# EAGLE board EDCPSUMK2_2040 (EAGLE 9.6.2)
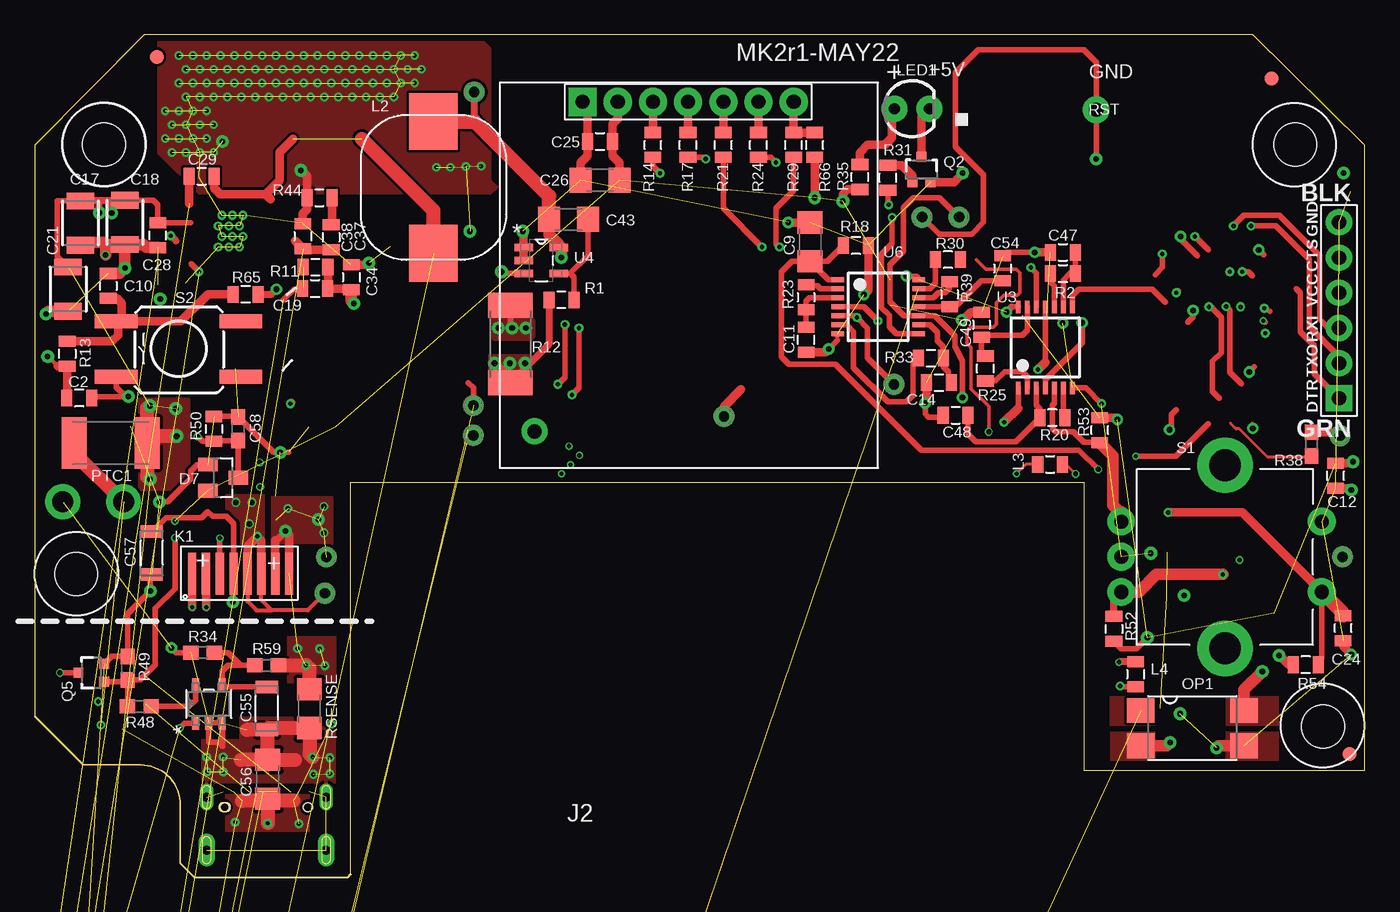
[diagram p5: board, top side]
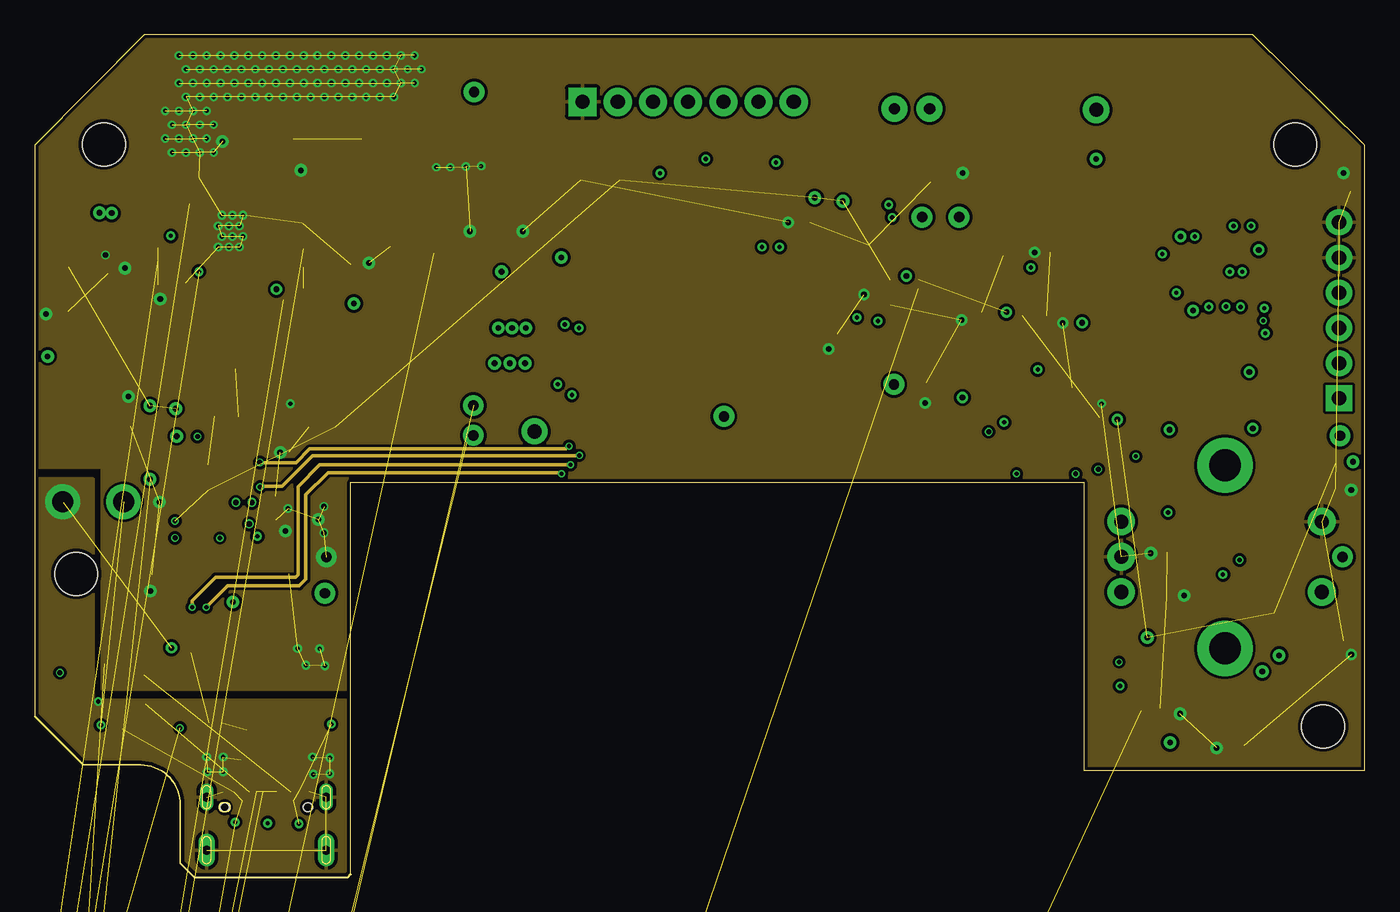
[diagram p6: board, inner layer GND]
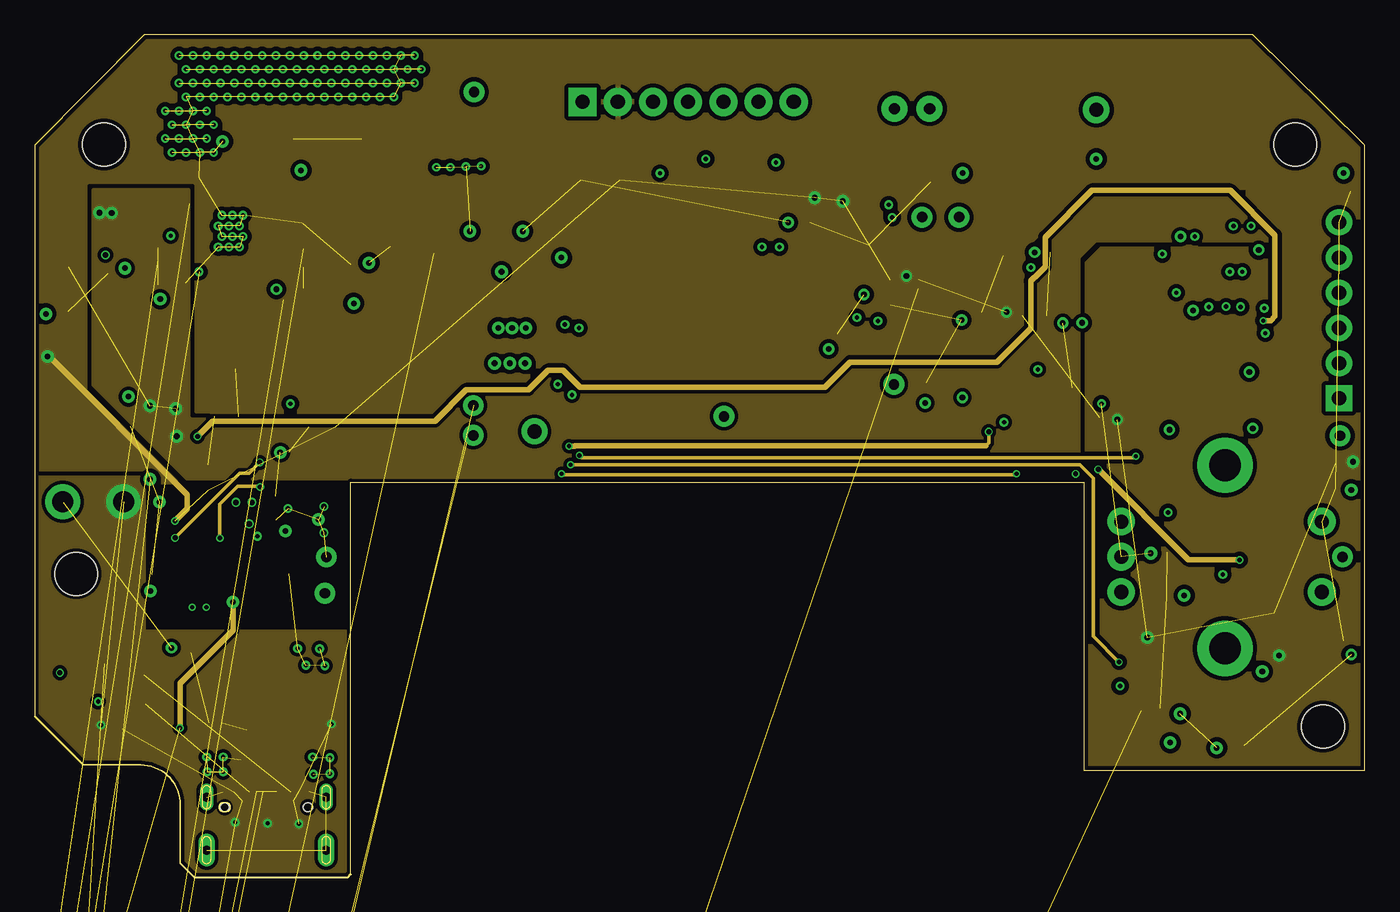
[diagram p7: board, inner layer PWR]
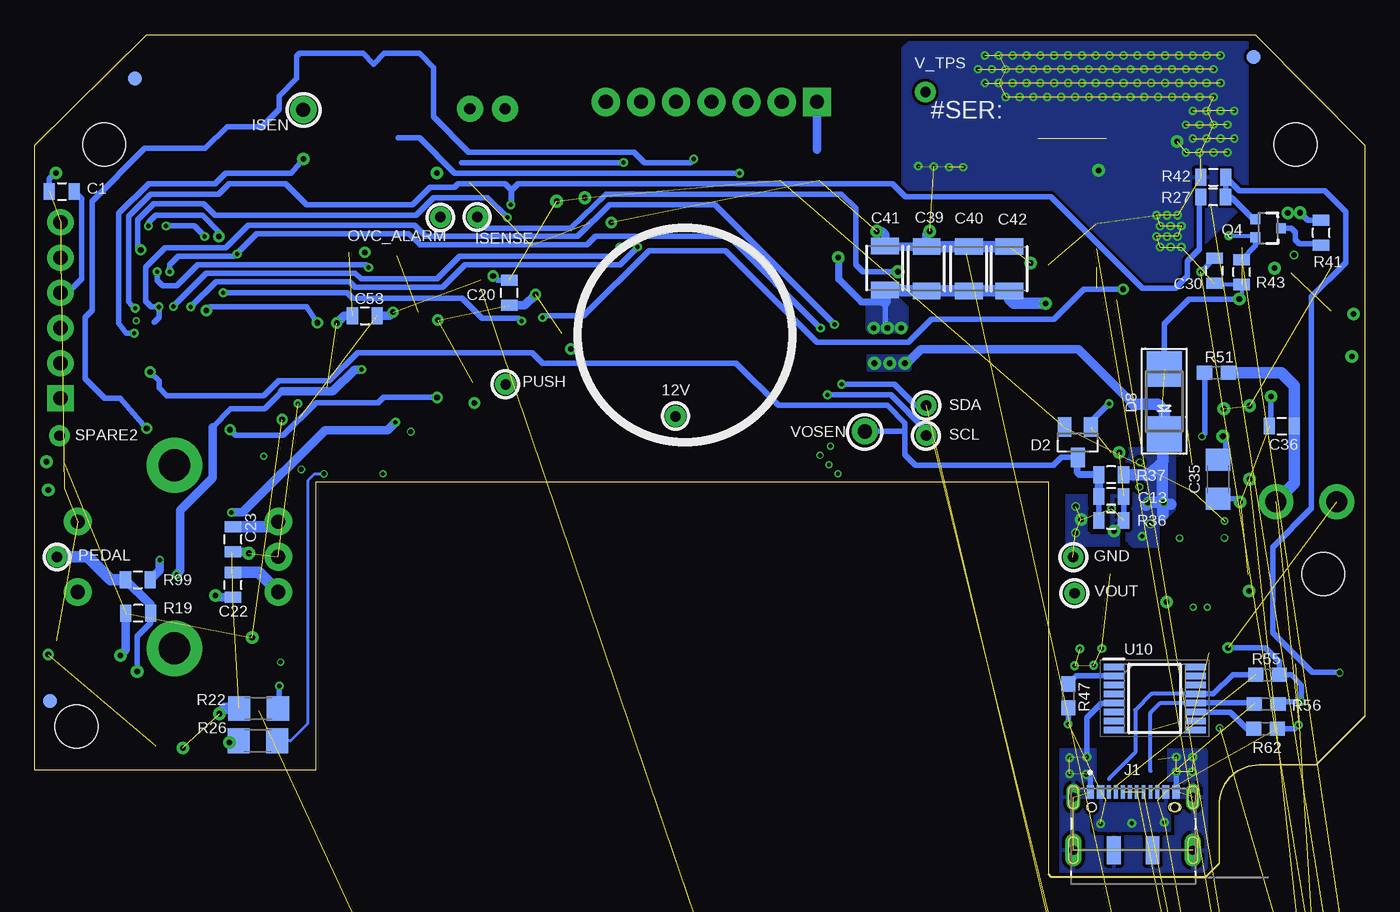
[diagram p8: board, bottom side, seen from below]

Size 96 x 60.8 mm. Coordinates in mm from the lower left corner, seen from the top.
Outline: 96,7.7 96,52.8 87.9,60.8 7.9,60.8 0,52.8 0,11.6 3.5,8.1 7.62,8.1 arc-90 10.5,5.22 10.5,1 11.5,0 22.6,0 22.8,0.2 22.8,28.5 75.71,28.5 75.71,7.7 96,7.7
Copper layers (1*2*15*16): Top 0.035mm / dielectric 0.2mm / GND 0.0175mm / dielectric 0.3mm / PWR 0.0175mm / dielectric 0.2mm / Bottom 0.035mm
Design rules "SeeedStudio_4layer_DRU_no_angle_20140221 *": minimum track width 8mil, minimum drill 12mil, track to track 8mil, track to pad 8mil, pad to pad 8mil, via to via 8mil, smd to smd 0mil, copper to edge 10mil, drill to drill 8mil, minimum pad ring 6mil, minimum via ring 4mil, stop-mask expansion 4mil, vias tented up to drill 25mil, thermal gap 10mil
Net classes: 1 vcc: width 0.254 mm
Holes 3.1 mm at 4.98,52.88 90.98,52.88 2.98,21.88 92.98,10.88

## Footprints (pad centres in the part's own frame; a part is rotated, then mirrored left to right if it is on the bottom)
PKMCS0909 = smd 2.6 x 3.4: 1 -4.5,0; 2 4.5,0
0805 = smd 0.8 x 1.2: 1 -0.9,0; 2 0.9,0
1206 = smd 1.6 x 1.8: 1 -1.4,0; 2 1.4,0
1210 = smd 1.2 x 2: 1 -1.6,0; 2 1.6,0
WCAP-CSGP_1206 = smd 0.9 x 1.6: 1 -1.55,0; 2 1.55,0
C0805 = smd 1.3 x 1.5: 1 -0.95,0; 2 0.95,0
SOT23 = smd 1 x 1.4: 1 -0.95,-1.1; 2 0.95,-1.1; 3 0,1.1
DIONM5127X229N = smd 2.2 x 1.55: 1 -2.05,0; 2 2.05,0
SOT95P230X110-3N = smd 1.05 x 0.6: 1 -1.1,0.95; 2 -1.1,-0.95; 3 1.1,0
DIOM4325X244N = smd 2.33 x 1.55: A 2.135,0; C -2.135,0
SMADIODE = smd 2.54 x 2.54: A 2.349,0; C -2.349,0
FIDUCIAL-1X2 = smd 1 x 1: 1 0,0
SOIC127P790X216-8N = smd 1.65 x 0.65: 1 -3.6,1.905; 2 -3.6,0.635; 3 -3.6,-0.635; 4 -3.6,-1.905; 5 3.6,-1.905; 6 3.6,-0.635; 7 3.6,0.635; 8 3.6,1.905
SOIC127P600X163-9N = smd 1.5 x 0.65: 1 -2.7,1.905; 2 -2.7,0.635; 3 -2.7,-0.635; 4 -2.7,-1.905; 5 2.7,-1.905; 6 2.7,-0.635; 7 2.7,0.635; 8 2.7,1.905 | smd 2.71 x 3.35: 9 0,0
PAD.03X.03 = smd 0.762 x 0.762: P$1 0,0
JAE_DX07S016JA1R1500 = smd 0.52 x 1: 1 -3.1,1.1; 2 -2.35,1.1; 11 2.35,1.1; 12 3.1,1.1 | smd 0.27 x 1: 3 -1.75,1.1; 4 -1.25,1.1; 5 -0.75,1.1; 6 -0.25,1.1; 7 0.25,1.1; 8 0.75,1.1; 9 1.25,1.1; 10 1.75,1.1 | smd 1 x 2: S1 -1.4,-3.1; S2 1.4,-3.1 | drill 0.65 long: S3 -4.32,0.725; S4 4.32,0.725 | drill 0.65 pad 1.2 long: S5 -4.32,-3.1; S6 4.32,-3.1 | hole 0.6: 3,0 | hole 0.63: 3,0; -3,0
RP2040TR7 = smd 0.875 x 0.2: 1 -3.438,2.6; 2 -3.438,2.2; 3 -3.438,1.8; 4 -3.438,1.4; 5 -3.438,1; 6 -3.438,0.6; 7 -3.438,0.2; 8 -3.438,-0.2; 9 -3.438,-0.6; 10 -3.438,-1; 11 -3.438,-1.4; 12 -3.438,-1.8; 13 -3.438,-2.2; 14 -3.438,-2.6; 29 3.438,-2.6; 30 3.438,-2.2; 31 3.438,-1.8; 32 3.438,-1.4; 33 3.438,-1; 34 3.438,-0.6; 35 3.438,-0.2; 36 3.438,0.2; 37 3.438,0.6; 38 3.438,1; 39 3.438,1.4; 40 3.438,1.8; 41 3.438,2.2; 42 3.438,2.6 | smd 0.2 x 0.875: 15 -2.6,-3.438; 16 -2.2,-3.438; 17 -1.8,-3.438; 18 -1.4,-3.438; 19 -1,-3.438; 20 -0.6,-3.438; 21 -0.2,-3.438; 22 0.2,-3.438; 23 0.6,-3.438; 24 1,-3.438; 25 1.4,-3.438; 26 1.8,-3.438; 27 2.2,-3.438; 28 2.6,-3.438; 43 2.6,3.438; 44 2.2,3.438; 45 1.8,3.438; 46 1.4,3.438; 47 1,3.438; 48 0.6,3.438; 49 0.2,3.438; 50 -0.2,3.438; 51 -0.6,3.438; 52 -1,3.438; 53 -1.4,3.438; 54 -1.8,3.438; 55 -2.2,3.438; 56 -2.6,3.438 | smd 3.2 x 3.2: 57 0,0
FTDI_DEVICE_SIDE = drill 1.016 pad 1.88 square: P$1 -6.35,0 | drill 1.016 pad 1.88: P$2 -3.81,0; P$3 -1.27,0; P$4 1.27,0; P$5 3.81,0; P$6 6.35,0
OLED_LCD = drill 1.016 pad 2.032 square: 1 -7.42,13.7 | drill 1.016 pad 2.032: 2 -4.88,13.7; 3 -2.34,13.7; 4 0.2,13.7; 5 2.74,13.7; 6 5.28,13.7; 7 7.82,13.7
FLEX8 = smd 0.6 x 3: 1 0.8,2.05; 2 1.8,2.05; 3 2.8,2.05; 4 3.8,2.05; 5 4.8,2.05; 7 5.8,2.05; 8 6.8,2.05; 9 7.8,2.05
NRS4018T100MDGJ = smd 1.2 x 3.7: 1 -1.4,0; 2 1.4,0
WE-LHMI = smd 4.1 x 3.5: 1 -4.75,0; 2 4.75,0
LED3MM = drill 0.813 pad 1.88: A -1.27,0; K 1.27,0
SMT0540SR = smd 1.5 x 1.3: 1 -2.25,-1.6; 2 2.25,-1.6 | smd 1.3 x 1.3: 3 -2.25,1.9
SMD4 = smd 1.78 x 2: 1 -1.27,-3.725; 2 1.27,-3.725; 3 1.27,3.725; 4 -1.27,3.725
SOT95P280X100-6N = smd 1.05 x 0.55: 1 -1.3,0.95; 2 -1.3,0; 3 -1.3,-0.95; 4 1.3,-0.95; 5 1.3,0; 6 1.3,0.95
1812L = smd 1.8 x 3.7: 1 -2.6,0; 2 2.65,0
SOT23_PJA3416_PNJ = smd 0.864 x 0.508: 1 -1.232,0.95; 2 -1.232,-0.95; 3 1.232,0
SOT323 = smd 0.7 x 0.7: 1 -0.65,-0.925; 2 0.65,-0.925; 3 0,0.925
R2512 = smd 1.8 x 3.2: 1 -2.8,0; 2 2.8,0
0603 = smd 1.1 x 1: 1 -0.85,0; 2 0.85,0
ROTARY_ENC_PLAIN = drill 1.016 pad 2: A 7.493,-2.54; B 7.493,2.54; C 7.493,0; SW+ -6.985,2.54; SW- -6.985,-2.54 | drill 2.286 pad 4: P$3 0,6.604; P$4 0,-6.604
TAC_SW_SMD_KSC931G = smd 3.1 x 1: 1 -4.5,2; 2 4.5,2; 3 -4.5,-2; 4 4.5,-2
1X01_POGOPIN_HOLE_LARGE = drill 0.75 pad 1.5: 1 0,0
1X01NS-KIT = drill 1.016 pad 1.88: 1 0,0
SOT23-6 = smd 0.55 x 1.2: 1 0.95,1.3; 2 0,1.3; 3 -0.95,1.3; 4 -0.95,-1.3; 5 0,-1.3; 6 0.95,-1.3
TSSOP14 = smd 0.35 x 0.9: 1 -1.95,-2.925; 2 -1.3,-2.925; 3 -0.65,-2.925; 4 0,-2.925; 5 0.65,-2.925; 6 1.3,-2.925; 7 1.95,-2.925; 8 1.95,2.925; 9 1.3,2.925; 10 0.65,2.925; 11 0,2.925; 12 -0.65,2.925; 13 -1.3,2.925; 14 -1.95,2.925
SOT95P280X145-5N = smd 1.321 x 0.559: 1 -1.27,0.94; 2 -1.27,0; 3 -1.27,-0.94; 4 1.27,-0.94; 5 1.27,0.94
SO16 = smd 0.6 x 1.2: 1 -4.445,-2.8; 2 -3.175,-2.8; 3 -1.905,-2.8; 4 -0.635,-2.8; 5 0.635,-2.8; 6 1.905,-2.8; 7 3.175,-2.8; 8 4.445,-2.8; 9 4.445,2.8; 10 3.175,2.8; 11 1.905,2.8; 12 0.635,2.8; 13 -0.635,2.8; 14 -1.905,2.8; 15 -3.175,2.8; 16 -4.445,2.8
21-0057F_MXM = smd 0.978 x 0.508: 1 -1.365,0.95; 2 -1.365,0; 3 -1.365,-0.95; 4 1.365,-0.95; 5 1.365,0.95
SOP65P640X120-16N = smd 1.475 x 0.45: 1 -2.938,2.275; 2 -2.938,1.625; 3 -2.938,0.975; 4 -2.938,0.325; 5 -2.938,-0.325; 6 -2.938,-0.975; 7 -2.938,-1.625; 8 -2.938,-2.275; 9 2.938,-2.275; 10 2.938,-1.625; 11 2.938,-0.975; 12 2.938,-0.325; 13 2.938,0.325; 14 2.938,0.975; 15 2.938,1.625; 16 2.938,2.275
ABLS = smd 5.6 x 2.1: 1 -4.75,0; 2 4.75,0

## Placement (x,y rotation side)
BZ1  PKMCS0909E4000-R1  [PKMCS0909]  -31.14,-244.04 0 top  (outside the outline)
C1  100n  [0805]  94.03,49.48 0 bottom
C2  100n  [0805]  3.21,34.58 180 top
C3  100n  [0805]  -0.72,-15.6 0 top  (outside the outline)
C4  100n  [0805]  -0.72,-18.88 0 top  (outside the outline)
C5  100n  [0805]  -0.72,-22.16 0 top  (outside the outline)
C6  100n  [0805]  -0.72,-25.44 0 top  (outside the outline)
C7  27p  [0805]  -0.72,-28.72 0 top  (outside the outline)
C8  100n  [0805]  -3.26,-61.76 0 top  (outside the outline)
C9  1uF  [1206]  55.96,45.84 90 top
C10  100n  [0805]  5.28,42.66 270 top
C11  1uF  [0805]  55.67,38.79 90 top
C12  100n  [0805]  93.88,28.96 90 top
C13  1uF  [0805]  18.29,27.47 180 bottom
C14  100n  [0805]  65.24,35.69 0 top
C15  1uF  [1206]  -2.28,-65.35 0 top  (outside the outline)
C16  100n  [0805]  -0.72,-38.56 0 top  (outside the outline)
C17  4.7uF  [1210]  3.28,47.2 270 top
C18  4.7uF  [1210]  6.49,47.25 270 top
C19  N.C.  [0805]  20.22,42.47 0 top
C20  100n  [0805]  61.75,42.17 90 bottom
C21  4.7uF  [1210]  2.39,42.43 270 top
C22  100n  [0805]  81.69,21.09 90 bottom
C23  100n  [0805]  81.69,24.39 90 bottom
C24  100n  [0805]  94.44,17.98 90 top
C25  100n  [0805]  40.79,53.09 0 top
C26  10uF  [1206]  40.79,50.3 180 top
C27  100n  [0805]  -0.72,-41.84 0 top  (outside the outline)
C28  100n  [0805]  8.87,46.31 90 top
C29  100n  [0805]  12.03,50.58 0 top
C30  33n  [0805]  10.83,43.76 90 bottom
C31  1uF  [1206]  0.26,-45.43 0 top  (outside the outline)
C32  1uF  [1206]  0.26,-49.15 0 top  (outside the outline)
C33  100n  [0805]  -0.72,-52.55 0 top  (outside the outline)
C34  100n  [0805]  22.84,43.29 270 top
C35  10uF  [1206]  10.57,28.71 270 bottom
C36  100n  [0805]  5.98,32.55 0 bottom
C37  10n  [0805]  21.38,46.18 270 top
C38  16p  [0805]  19.34,46.24 270 top
C39  22uF  [1210]  31.61,43.91 90 bottom
C40  22uF  [1210]  28.56,43.91 90 bottom
C41  22uF  [1210]  34.62,43.96 90 bottom
C42  22uF  [1210]  25.64,43.91 90 bottom
C43  10uF  [1206]  38.52,47.46 0 top
C44  10uF  [1206]  -34.55,-259.86 0 top  (outside the outline)
C45  27p  [0805]  -5.97,-78.83 0 top  (outside the outline)
C46  27p  [0805]  -5.97,-82.11 0 top  (outside the outline)
C47  100n  [0805]  74.2,45.09 0 top
C48  100n  [0805]  66.46,33.33 0 top
C49  100n  [0805]  68.33,39.86 270 top
C50  22u 10V X5R  [0805]  -11.97,-132 0 top  (outside the outline)
C51  27p  [0805]  -11.97,-138.56 0 top  (outside the outline)
C52  27p  [0805]  -11.97,-141.84 0 top  (outside the outline)
C53  100n  [0805]  72.16,40.52 0 bottom
C54  1uF  [0805]  69.86,43.93 270 top
C55  100n  [WCAP-CSGP_1206]  16.75,12.18 90 top
C56  1uF  [1206]  16.8,7.07 90 top
C57  100n  [WCAP-CSGP_1206]  8.43,23.38 90 top
C58  100nF  [0805]  12.93,32.34 270 top
C59  100n  [0805]  -29.29,-194.36 0 top  (outside the outline)
C60  100n  [C0805]  -28.82,-202.51 0 top  (outside the outline)
C61  100n  [0805]  -25.23,-252.42 0 top  (outside the outline)
C62  22u 10V X5R  [0805]  -41.42,-259.98 0 top  (outside the outline)
C63  4.7u 50V X5R  [0805]  -44.37,-259.98 0 top  (outside the outline)
C64  4.7u 50V X5R  [0805]  -47.32,-259.98 0 top  (outside the outline)
D2  BAV199  [SOT23]  20.7,31.37 180 bottom
D3  SMAJ24CA  [DIONM5127X229N]  -26.88,-214.85 0 top  (outside the outline)
D4  PESD5V0U2BT,215  [SOT95P230X110-3N]  -28.04,-218.3 0 top  (outside the outline)
D5  3SMAJ5923B-TP  [DIOM4325X244N]  -32.8,-226.68 0 top  (outside the outline)
D6  BAV199  [SOT23]  -34.63,-233.66 0 top  (outside the outline)
D7  BAV199  [SOT23]  13.59,28.83 270 top
D8  RB060M-60TR  [SMADIODE]  14.46,34.33 90 bottom
FID1  FIDUCIAL1X2  [FIDUCIAL-1X2]  89.27,57.64 0 top
FID2  FIDUCIAL1X2  [FIDUCIAL-1X2]  94.9,8.89 0 top
FID3  FIDUCIAL1X2  [FIDUCIAL-1X2]  8.03,59.19 0 bottom
FID4  FIDUCIAL1X2  [FIDUCIAL-1X2]  8.79,59.19 0 top
FID5  FIDUCIAL1X2  [FIDUCIAL-1X2]  88.76,57.64 0 bottom
FID6  FIDUCIAL1X2  [FIDUCIAL-1X2]  94.9,12.7 0 bottom
IC1  W25Q64JVSSIQ  [SOIC127P790X216-8N]  2.46,-57.42 0 top  (outside the outline)
IC3  AP64501SP-13  [SOIC127P600X163-9N]  -19.88,-165.37 0 top  (outside the outline)
IN+  TEST-POINT3  [PAD.03X.03]  6.4,27.1 0 top
IN-  TEST-POINT3  [PAD.03X.03]  2.05,27.05 0 top
J1  DX07S016JA1R1500  [JAE_DX07S016JA1R1500]  16.7,5.05 0 bottom
J2  RP2040TR7  [RP2040TR7]  3.44,-9.3 0 top  (outside the outline)
J4  FTDI_DEVICE  [FTDI_DEVICE_SIDE]  94.13,40.9 90 top
J6  Display  [OLED_LCD]  46.95,42.24 0 top
K1  FLEX8  [FLEX8]  10.54,19.84 0 top
L1  NRS4018T4R7MDGJ  [NRS4018T100MDGJ]  -9.56,-146.8 0 top  (outside the outline)
L2  4.7uH  [WE-LHMI]  28.77,49.78 90 top
L3  MMZ2012Y202BT000  [0805]  73.28,29.79 0 top
L4  MMZ2012Y202BT000  [0805]  79.45,14.64 270 top
L5  MMZ2012Y202BT000  [0805]  -29.29,-191.08 0 top  (outside the outline)
L6  MMZ2012Y202BT000  [0805]  -22.65,-191.08 0 top  (outside the outline)
L7  MMZ2012Y202BT000  [0805]  -31.87,-252.42 0 top  (outside the outline)
LED1  [LED3MM]  63.31,55.45 0 top
LS1  SMT-0540-S-R  [SMT0540SR]  -2.84,-90.9 0 top  (outside the outline)
OP1  LTV816S  [SMD4]  83.54,10.76 270 top
PS1  AP63201WU-7  [SOT95P280X100-6N]  -6.64,-122.29 0 top  (outside the outline)
PTC1  2A NOM / 3.5A LIM  [1812L]  5.49,31.32 180 top
Q1  PJA3416AE_R1_00001  [SOT23_PJA3416_PNJ]  5.5,-105.78 0 top  (outside the outline)
Q2  2N7002PW  [SOT323]  63.98,51.06 0 top
Q4  2N7002PW  [SOT323]  6.96,46.83 270 bottom
Q5  2N7002PW  [SOT323]  4.07,14.75 90 top
R1  10K  [0805]  38,41.66 180 top
R2  1K  [0805]  74.2,43.56 0 top
R3  N.C.  [0805]  -29.29,-211.27 0 top  (outside the outline)
R4  N.C  [0805]  -25.79,-172.77 0 top  (outside the outline)
R5  11K  [0805]  -26.36,-194.36 0 top  (outside the outline)
R6  5K6  [0805]  -23.43,-194.36 0 top  (outside the outline)
R7  2K8  [0805]  -20.5,-194.36 0 top  (outside the outline)
R8  1K4  [0805]  -17.57,-194.36 0 top  (outside the outline)
R9  180K  [0805]  -29.29,-197.64 0 top  (outside the outline)
R10  91K  [0805]  -26.36,-197.64 0 top  (outside the outline)
R11  10k  [0805]  20.25,44.02 0 top
R12  0.05R / 1W  [R2512]  34.32,38.47 270 top
R13  2K2  [0805]  2.33,37.77 270 top
R14  33  [0805]  44.6,52.84 90 top
R15  10k  [0603]  -3.15,-69.05 0 top  (outside the outline)
R16  1K  [0805]  -5.97,-85.39 0 top  (outside the outline)
R17  33  [0805]  47.14,52.84 90 top
R18  N.C.  [0805]  59.26,45.58 180 top
R19  1K  [0805]  88.52,19.04 180 bottom
R20  1K  [0805]  73.43,33.15 180 top
R21  33  [0805]  49.68,52.84 90 top
R22  330  [1206]  79.84,12.17 180 bottom
R23  2K2  [0805]  55.67,41.84 270 top
R24  33  [0805]  52.22,52.84 90 top
R25  1K  [0805]  68.61,36.71 90 top
R26  330  [1206]  79.88,9.84 180 bottom
R27  1k  [0805]  10.93,49.08 180 bottom
R28  1K  [0805]  -11.97,-128.72 0 top  (outside the outline)
R29  33  [0805]  54.76,52.84 90 top
R30  330  [0805]  65.91,44.56 180 top
R31  33  [0805]  61.57,50.46 90 top
R32  1K  [0805]  -11.97,-135.28 0 top  (outside the outline)
R33  330  [0805]  64.67,37.46 0 top
R34  N.A  [0603]  12.1,16.2 0 top
R35  330  [0805]  59.55,50.52 90 top
R36  75K  [0805]  18.29,25.75 0 bottom
R37  150K  [0805]  18.29,29.04 180 bottom
R38  N.A  [0603]  92.15,31.25 90 top
R39  10K  [0805]  66.02,42.05 270 top
R40  43K  [0805]  -23.43,-197.64 0 top  (outside the outline)
R41  330k  [0805]  3.13,46.5 90 bottom
R42  10K  [0805]  10.92,50.5 0 bottom
R43  27k  [0805]  8.87,43.67 90 bottom
R44  25k  [0805]  20.54,49.03 0 top
R45  22K  [0805]  -20.5,-197.64 0 top  (outside the outline)
R46  33  [0805]  -22.3,-252.42 0 top  (outside the outline)
R47  100R  [0603]  21.39,13.09 90 bottom
R48  100R  [0603]  7.54,12.32 180 top
R49  10k  [0603]  6.7,15.08 270 top
R50  56k  [0603]  14.66,32.36 90 top
R51  220k  [0603]  10.69,36.41 180 bottom
R52  2K2  [0805]  77.89,17.91 270 top
R53  2K2  [0805]  76.86,32.26 90 top
R54  2K2  [0805]  91.73,15.33 180 top
R55  5k1  [0603]  7,14.6 180 bottom
R56  5k1  [0603]  7.1,12.5 180 bottom
R57  10k  [0805]  -19.37,-252.42 0 top  (outside the outline)
R58  330  [0805]  -38.47,-259.98 0 top  (outside the outline)
R59  1k  [0603]  16.73,15.29 180 top
R61  330  [0805]  -35.52,-256.22 0 top  (outside the outline)
R62  100k  [0603]  7.15,10.7 0 bottom
R65  33  [0805]  15.22,42.05 180 top
R66  10K  [0805]  56.29,52.84 90 top
R99  33  [0805]  88.55,21.47 0 bottom
RSENSE  100mR  [1206]  19.81,12.16 90 top
S1  ROTARTY_ENCODER  [ROTARY_ENC_PLAIN]  85.9,23.12 180 top
S2  [TAC_SW_SMD_KSC931G]  10.37,38.1 180 top
TP1  [1X01_POGOPIN_HOLE_LARGE]  94.2,31.85 0 top
TP2  VCCIO  [1X01_POGOPIN_HOLE_LARGE]  49.73,33.25 0 top
TP3  M01NOSILK-KIT  [1X01NS-KIT]  36.07,32.16 0 top
TP4  [1X01_POGOPIN_HOLE_LARGE]  64.03,47.63 0 top
TP5  PEDAL  [1X01_POGOPIN_HOLE_LARGE]  94.39,23.12 0 top
TP6  [1X01_POGOPIN_HOLE_LARGE]  31.65,34.04 0 top
TP7  [1X01_POGOPIN_HOLE_LARGE]  31.65,31.88 0 top
TP9  [1X01_POGOPIN_HOLE_LARGE]  62,35.56 0 top
TP10  [1X01_POGOPIN_HOLE_LARGE]  66.7,47.63 0 top
TP11  [1X01_POGOPIN_HOLE_LARGE]  20.93,20.49 0 top
TP12  [1X01_POGOPIN_HOLE_LARGE]  21.04,23.1 0 top
TP14  [1X01_POGOPIN_HOLE_LARGE]  31.7,56.66 0 top
U1  MCP4725  [SOT23-6]  -27.77,-207.73 0 top  (outside the outline)
U3  7414  [TSSOP14]  72.92,38.23 0 top
U4  MAX9938FEUK+T  [SOT95P280X145-5N]  36.55,44.5 0 top
U6  7414  [TSSOP14]  60.86,41.15 270 top
U7  TPIC2810D  [SO16]  -23.66,-186.21 0 top  (outside the outline)
U9  MAX9064EUK+T  [21-0057F_MXM]  12.55,12.5 90 top
U10  IP2721  [SOP65P640X120-16N]  15.15,12.9 0 bottom
Y1  ABLS-12.000MHZ-B4-T  [ABLS]  3.74,-74.04 0 top  (outside the outline)

## Tracks (layer width: path | path; a pad name or v marks a point on that pad's centre or on a via)
C_CC1  (1 unrouted)
C_CC2  (1 unrouted)
CC1
  Bottom 0.305: U10.13 15.38,13.23 16.55,12.05 16.55,9 18.45,7.1
  Bottom 0.406: U10.13 10.91,13.23 9.51,14.62 7.82,14.62
CC2
  Bottom 0.305: 15.45,7.65 15.45,11.85 14.72,12.57 U10.12
  Bottom 0.406: U10.12 8.02,12.57
CS
  Top 0.406: J6.7
  Top 0.61: J6.7 R29.2 R66.2
D0
  Top 0.406: J6.3
  Top 0.61: R14.2 J6.3
D1
  Top 0.406: J6.4
  Top 0.61: R17.2 J6.4
DSP_RST  (via drill 0.3 pad 0.64)
  Top 0.406: 85.49,34.55 84.99,35.06 84.99,37.22 85.62,37.85 85.62,40.41 84.89,41.15 v84.74,41.15 | R21.1 49.68,48.26 v52.48,45.47
  Bottom 0.406: v52.48,45.47 53.75,44.2 64.92,44.2 66.55,42.57 72.85,42.57 73.26,42.98 82.91,42.98 v84.74,41.15
DTR
  Top 0.406: J4.P$1 92.36,36.33 92.36,38.36 91.34,39.37 91.34,42.17 91.06,42.45
EN_DCDC  (via drill 0.3 pad 0.64)
  Top 0.406: R31.1 61.57,48.57 v61.62,48.52 | 89.15,40.83 v88.75,41.06
  Bottom 0.406: v88.75,41.06 89.02,41.32 89.21,41.54 89.21,47.7 87.63,49.28 82.7,49.28 81.94,50.04 77.88,50.04 76.35,48.52 68.73,48.52 67.46,49.79 65.69,49.79 65.43,50.04 62.05,50.04 R31.1 61.57,48.57 v61.62,48.52 61.62,49.53 61.11,50.04 34.08,50.04 33.15,49.11 22.64,49.11 16.03,42.5 13.66,42.5 12.8,43.35 12.8,44.44 11.93,45.31 11.93,48.98 R27.2
EN_TPS54531  (via drill 0.3 pad 0.64)  (1 unrouted)
  Top 0.305: 9.82,46.28 v9.8,46.28
  Top 0.508: 10.18,45.91 9.82,46.28
  Bottom 0.305: v9.8,46.28 7.99,46.28 Q4.2
  Bottom 0.406: Q4.2 7.88,45.55 R43.2
FB  (3 unrouted)
FB_DAC  (1 unrouted)
GND  (via drill 0.3 pad 0.6, 0.3 pad 0.61, 0.3 pad 0.64, 0.4 pad 0.64, 0.4 pad 0.9, 0.41, 0.41 pad 0.81, 0.41 pad 0.91)  (187 unrouted)
  Top 0.305: 3.48,45.8 C17.2 | 19.3,47.18 C38.1 19.33,47.16 | 35.28,46.54 v35.21,46.61 | 54.39,47.24 v54.38,47.25 | 8.81,45.47 C28.1 | 57.94,38.73 U6.7
  Top 0.406: U3.7 75.85,35.31 v76.99,34.17 | v18.08,24.98 18.35,24.72 | 18.31,30.65 v17.7,30.65 17.22,30.65 R50.2 14.63,33.24 C58.1 | Q5.2 5.52,15.93 R49.1 6.7,19.02 v8.32,20.65 8.32,21.72 C57.1 | C54.1 70.12,45.09 v72.16,45.09 | v64.26,34.22 64.26,33.43 64.49,33.2 65.42,33.2 C48.1 | v57.3,38.1 57.94,38.73 | C2.1 4.21,34.68 6.75,34.68 v6.76,34.67 6.55,34.67 5.87,35.36 S2.2 | D7.1 11.72,29.77 11.25,29.3 11.25,28.75 9.58,27.09 v8.98,27.09
  Top 0.508: 19.81,15.04 v19.55,15.3 | v18.08,24.98 17.43,24.33 17.35,24.33
  Top 0.61: 19.33,47.16 19.33,47.88 19.64,48.19 R44.1 19.64,50.57 v19.2,51.01 | C34.1 23.96,44.19 v24.11,44.33 | C12.1 94.91,28.06 v95.02,27.94 | v95.02,16.06 94.44,16.65 C24.1 | 18.51,34.23 v18.44,34.17 | U4.2 U4.1 35.28,46.54 | C26.2 39.39,51.56 39.89,52.06 C25.1 39.89,55.58 J6.1 | C11.1 57.09,37.89 v57.3,38.1 | C49.1 67.56,40.76 67,40.2 v66.89,40.2 | C47.1 v72.16,45.09 | C9.2 54.39,47.24 | Q2.2 66.36,50.13 v66.96,50.8 | R18.1 60.16,42.36 v59.84,42.04 | 85.46,9.49 v85.3,9.33 | C14.1 64.34,34.3 v64.26,34.22 | 18.35,24.72 K1.9 | 17.35,24.33 K1.8
  Top 0.813: C21.2 0.98,40.84 v0.79,40.64 | C18.2 5.1,45.65 | 3.48,45.8 5,45.8 5.1,45.7 5.1,45.65 | C10.1 6.12,43.56 v6.5,43.95 v6.49,43.96 C18.2 | C18.2 7.85,45.65 8.03,45.47 8.81,45.47 | OP1.3 85.46,9.49 | 5.1,45.65 v5.1,44.9
  Top 1.016: RSENSE.2 19.81,15.04 | R59.1 17.6,15.3 v19.55,15.3
  Bottom 0.305: C30.1 10.75,42.77 R43.1 8.87,41.89 v9.04,41.71 | 34.57,45.51 C41.2 34.57,45.61
  Bottom 0.406: C1.1 94.93,50.39 94.71,50.6 94.66,50.6 v94.46,50.8 | 81.74,23.44 C23.1 | v18.08,24.98 17.36,25.7 17.36,25.8 | R36.2 C13.1 | D2.1 19.75,32.86 v18.44,34.17 | C35.2 9.21,27.31 v8.98,27.09 | C36.1 6.76,32.67 v6.76,34.67 | D8.A 14.46,39.94 12.69,41.71 v9.04,41.71
  Bottom 0.508: R36.2 17.36,25.78 17.36,25.8
  Bottom 0.61: 34.57,45.51 C39.2 31.61,46.4 v31.4,46.61 | v35.21,46.61 34.83,46.61 34.57,46.36 34.57,45.61 | C53.1 73.66,40.52 v74.2,39.98 | C22.1 82.82,20.19 v82.96,20.32 | C23.1 80.66,23.49 v80.55,23.37 | C20.1 60.62,41.27 v59.84,42.04 | J6.1 39.53,52.49
  Bottom 0.813: C42.2 C40.2 C39.2 | R22.2 82.28,12.17 v82.66,11.79
  other vias: 13.54,53.09 15.01,47.76 14.25,47.76 13.49,47.76 13.23,46.99 14,46.99 14.76,46.99 15.01,46.23 14.25,46.23 13.49,46.23 13.23,45.47 14,45.47 14.76,45.47 10.4,59.3 11.4,59.3 12.4,59.3 13.4,59.3 14.4,59.3 15.4,59.3 16.4,59.3 17.4,59.3 18.4,59.3 19.4,59.3 20.4,59.3 21.4,59.3 22.4,59.3 23.4,59.3 24.4,59.3 25.4,59.3 26.4,59.3 27.4,59.3 10.9,58.3 11.9,58.3 12.9,58.3 13.9,58.3 14.9,58.3 15.9,58.3 16.9,58.3 17.9,58.3 18.9,58.3 19.9,58.3 20.9,58.3 21.9,58.3 22.9,58.3 23.9,58.3 24.9,58.3 25.9,58.3 26.9,58.3 27.9,58.3 10.4,57.3 11.4,57.3 12.4,57.3 13.4,57.3 14.4,57.3 15.4,57.3 16.4,57.3 17.4,57.3 18.4,57.3 19.4,57.3 20.4,57.3 21.4,57.3 22.4,57.3 23.4,57.3 24.4,57.3 25.4,57.3 26.4,57.3 27.4,57.3 10.9,56.3 11.9,56.3 12.9,56.3 13.9,56.3 14.9,56.3 15.9,56.3 16.9,56.3 17.9,56.3 18.9,56.3 19.9,56.3 20.9,56.3 21.9,56.3 22.9,56.3 23.9,56.3 24.9,56.3 25.9,56.3 9.4,55.3 10.4,55.3 11.4,55.3 12.4,55.3 9.9,54.3 10.9,54.3 11.9,54.3 12.9,54.3 9.4,53.3 10.4,53.3 11.4,53.3 12.4,53.3 9.9,52.3 10.9,52.3 11.9,52.3 12.9,52.3 28.97,51.23 29.99,51.23 31.11,51.27 32.21,51.31 18.95,16.5 20.55,16.49 20.92,15.25 20.86,26.75 18.26,26.6 20.47,25.8 20.86,24.85
  pour Bottom: 11.94,49.38 11.94,45.32 12.8,44.45 12.8,43.18 13.57,42.42 15.88,42.42 18.34,44.89 18.34,47.96 18.75,48.37 18.75,49.08 18.44,49.38
  pour Top (no thermals): 85.96,10.47 85.96,8.44 89.77,8.44 89.77,10.47
  pour Top: 8.9,60.3 8.9,52.25 11.85,49.3 32.9,49.3 33.4,49.8 32.9,50.3 32.9,59.8 32.4,60.3
  pour Bottom: 8.41,60.3 8.41,48.79 12.9,44.3 18.4,44.3 22.9,48.8 32.9,48.8 33.4,49.3 33.4,59.8 32.9,60.3
  pour GND: 4.82,13.55 24.44,13.55 24.44,27.1 74.2,27.1 74.2,5 97.2,5 97.2,54.7 89.91,62 6.05,62 -1.39,54.56 -1.39,29.59 4.82,29.59
  pour Top: 18.21,14.04 21.73,14.04 21.73,17.36 18.21,17.36
  pour Top (isolate 0.254, rank 2): 17.1,27.44 17.1,24.2 17.2,24.1 21.4,24.1 21.5,24 21.5,27.44
  pour Bottom (isolate 0.406, rank 2): 17.25,27.55 21.55,27.55 21.55,23.95 17.1,23.95 17.1,27.4
GND_IN  (via drill 0.3 pad 0.6, 0.3 pad 0.64, 0.4 pad 0.8, 1.5 pad 2.5)  (16 unrouted)
  Top 0.406: R34.1 10.2,16.2 v9.85,16.55 | U9.3 13.55,11.09 13.55,9.45 13.27,9.73 12.55,9.73 U9.2 U9.3
  Top 0.508: IN-.P$1 v2,27.09
  Top 1.016: C55.1 16.88,10.76 RSENSE.1 19.81,8.9 v20.04,8.67 | C55.1 15.29,10.62 | C55.1 16.75,8.52 C56.2 | C56.2 18.77,8.47 | C56.2 14.88,8.47
  Bottom 0.406: R56.1 6.09,12.66 4.58,12.66 v4.56,12.68 4.56,13.86 5.3,14.6 R55.1 6.15,15.55 7.15,16.55 v9.85,16.55 | U10.5 18.11,12.56 18.99,12.56 20.04,11.51 v20.04,8.67 | J1.12 v13.59,7.62 | J1.1 19.8,7.12 v20.09,7.42
  other vias: 21.29,8.62 21.29,7.47 12.39,8.67 13.59,8.67 12.44,7.62
  pour GND: -1.09,28.78 4.2,28.78 4.2,12.8 24.2,12.8 24.2,-2 -1.09,-2
  pour Top: 12.02,6.8 21.7,6.8 21.7,11.55 12.02,11.55
  pour Bottom (isolate 0.254): 19.4,9.22 22,9.22 22,0.35 11.4,0.35 11.35,0.4 11.35,9.1 11.45,9.2 14.2,9.2 14.2,6.9 13.65,6.9 13.65,2.9 19.5,2.9 19.85,3.25 19.85,5.35 19.4,5.8
IN+  (via drill 0.3 pad 0.6, 0.3 pad 0.64, 1.5 pad 2.5)  (8 unrouted)
  Top 0.508: IN+.P$1 v6.4,27.09
  Top 1.016: v6.4,27.09 6.36,27.09 2.84,30.6 PTC1.2 | C56.1 16.93,5.54 18.66,5.54 | C56.1 v16.8,3.9 | C56.1 16.63,5.5 14.95,5.5
  Bottom 0.406: R47.1 v21.39,11.05 | v4.76,10.98 5.04,10.7 R62.2
  Bottom 0.813: v6.4,27.09 5.08,28.41 C36.2 5.08,35.47 6.02,36.41 R51.1
  other vias: 14.44,3.97 19.06,3.85
  pour Bottom (isolate 0.254, rank 2): 14,5.9 14,3.26 19.79,3.26 19.79,5.9
  pour Top: 13.77,6 19.79,6 19.79,3.29 13.77,3.29
  pour PWR (isolate 0.254, rank 2): -0.85,28.9 -0.85,10.6 4.25,5.5 11.05,-1.3 23.9,-1.3 23.9,17.7 23.8,17.8 7.95,17.8 7.95,28.75 7.95,28.85 7.95,28.9
IN_OVC  (via drill 0.3, 0.35)
  Top 0.254: 67.95,44.56 68.64,43.87 70.86,43.87 71.11,43.62 71.11,42.18 70.93,42 69.93,42 69.39,41.47 69.39,39.89 69.19,39.69 67.57,39.69 67.28,39.4 67.28,38.54 67.57,38.25 67.57,35.25 68.85,33.97 v68.85,32.14
  Top 0.406: R48.2 6.68,14.22 R49.2 | R49.2 6.57,14.11 Q5.1 | v10.11,24.48 10.11,20.83 8.7,19.41 8.7,15.33 7.59,14.23 R49.2
  GND 0.254: v10.11,24.48 v10.11,24.49 | v38.55,31.11 38.34,30.9 19.84,30.9 18.86,29.92 16.23,29.92 v16.23,29.93
  PWR 0.254: v10.11,24.48 14.77,29.15 15.45,29.15 v16.23,29.93 | v68.85,32.14 68.85,31.36 68.64,31.15
  PWR 0.406: v38.55,31.11 38.96,31.11 39,31.15 68.64,31.15
ISENSE  (via drill 0.3 pad 0.64, 0.41 pad 0.91, 1 pad 1.93)
  Top 0.406: U4.3 33.81,43.56 v33.68,43.69 | 88.82,39.23 v88.82,39.26 | TP4.1 65.28,46.38 67.62,46.38 68.48,47.25 68.48,50.68 66.45,52.71 66.45,58.04 68.1,59.69 75.72,59.69 76.61,58.81 v76.61,55.38 v76.61,51.82
  Bottom 0.406: v33.68,43.69 36.22,43.69 36.73,44.2 36.73,48.26 37.75,49.28 54.76,49.28 57.3,46.84 63.4,46.84 TP4.1 | v88.82,39.26 89.37,39.26 89.92,39.98 89.92,47.91 87.78,50.04 82.96,50.04 82.2,50.8 77.5,50.8 v76.61,51.82
MISO  (via drill 0.3 pad 0.64)
  Top 0.406: R24.1 53.12,51.94 v53.49,51.57
  Bottom 0.406: v53.49,51.57 65.18,51.57
MOSI  (via drill 0.3 pad 0.64, 0.41 pad 0.81)
  Top 0.406: R17.1 48.3,51.94 v48.41,51.82 | 87.89,32.66 v87.91,32.39
  Bottom 0.406: v48.41,51.82 48.67,51.57 51.97,51.57 52.73,52.33 64.67,52.33 67.21,54.87 67.21,58.42 68.23,59.44 70.77,59.44 71.53,58.68 72.29,59.44 76.86,59.44 77.07,59.23 77.07,57.64 78.36,56.35 78.36,55.43 79.63,54.16 82.12,54.16 83.7,52.58 88.04,52.58 91.85,48.77 91.85,40.9 92.36,40.39 92.36,35.97 90.93,34.55 89.82,34.55 88.17,32.64 v87.91,32.39
N$1  (1 unrouted)
N$2  (1 unrouted)
N$3  (2 unrouted)
N$4  (1 unrouted)
N$5  (1 unrouted)
N$6
  Top 0.406: J6.6
  Top 0.61: R24.2 J6.6
N$7  (1 unrouted)
N$8  (1 unrouted)
N$9  (1 unrouted)
N$10
  Top 0.406: U4.4 38.64,43.56 | R1.1 38.9,43.3 38.64,43.56 | C43.2 39.92,44.85 38.64,43.56
N$11
  Top 0.61: R35.2 59.55,52.29 60.1,52.84 61.37,52.84 61.88,53.34 61.88,55.29 LED1.A
N$12
  Top 0.61: Q2.3 63.98,54.86 LED1.K
N$13
  Top 0.406: U6.6 58.6,39.85 59.08,39.37 59.08,36.77 61.56,34.29 62.89,34.29 63.36,34.77 63.36,37.05 R33.1
N$14  (1 unrouted)
  Top 0.406: U6.13 64.61,42.45 65.01,42.84 R30.2
N$15
  Top 0.406: U6.12 64.86,41.8 65.23,42.17 65.69,42.17 66.02,42.5 R39.1
N$16  (1 unrouted)
N$17
  Top 0.406: 6,39.98 S2.4 6.25,40.49
  Top 0.61: R13.1 5.55,38.67 6,39.12 6,39.98 | C10.2 5.89,41.76 6.25,41.41 6.25,40.49 | S2.4 10.54,40.1 12.49,42.05 R65.2
N$18
  Top 0.406: U3.9 74.23,43.09 74.7,43.56 R2.2 C47.2
N$19  (1 unrouted)
N$21
  Top 0.61: R31.2 62.59,51.36 63.33,50.62 Q2.1
N$22
  Top 0.406: U3.10 73.58,42.66 73.31,42.93 73.31,43.55 R2.1
N$23
  Top 0.406: U3.6 74.23,33.26 R20.1
N$25
  Top 0.406: U3.2 71.62,36.13 71.27,36.48 70,36.48 69.34,35.82 R25.1
N$26
  Top 0.406: R25.2 68.33,37.89 C49.2 68.49,39.12 71.27,39.12 71.62,39.47 U3.13
N$28
  Top 0.406: U3.3 72.28,34.05 72.54,33.79 72.54,33.16 R20.2 70.82,31.44 67.91,31.44 67.36,31.99 C48.2
N$29
  Top 0.406: C11.2 R23.2 55.67,41.55 55.92,41.8 U6.3
N$30
  Bottom 0.406: J4.P$4 93.63,42.17 92.61,43.18 92.61,48.96 C1.2
N$34
  Top 0.406: U6.2 56.72,42.45 56.49,42.68 55.73,42.68 R23.1
N$35
  Bottom 0.406: R41.1 3.23,45.7 4.7,45.7 5,46.01 5,46.53 5.3,46.83 Q4.3
N$37
  Top 0.406: U6.9 64.6,39.85 65.13,39.32 65.13,38.71 65.53,38.31 65.53,37.49 R33.2 65.57,36.85 65.94,36.48 65.94,35.89 C14.2
N$38
  Top 0.61: TP1.1 93.8,31.85 93.55,32.1 R38.2
N$39
  Top 0.406: R39.2 66.45,41.15 68.32,43.03 C54.2 | U6.11 R39.2 | R39.2
N$40  (1 unrouted)
N$41  (via drill 0.41 pad 0.91)
  Top 0.406: 81.72,9.49 v81.95,9.71
  Top 0.813: OP1.2 81.72,9.49
  Bottom 0.406: v81.95,9.71 81.75,9.71 R26.2
  pour Top (no thermals): 77.63,10.47 77.63,8.44 80.88,8.44 80.88,10.47
N$43  (via drill 0.35)
  Top 0.203: L3.2 74.43,29.79 v75.12,29.1
  Bottom 0.203: v75.12,29.1 75.8,29.1 76.28,28.62 76.28,11.08 77.52,9.84 R26.1
N$44  (via drill 0.3 pad 0.64)  (1 unrouted)
  Top 0.406: 11.26,44.27 v11.84,43.69
  Bottom 0.406: v11.84,43.69 11.8,43.69 C30.2
N$45
  Bottom 0.406: R62.1 8.5,10.7 9.71,11.91 12.19,11.91 U10.11
N$46  (via drill 0.3 pad 0.64)
  Top 0.406: L4.2 78.39,13.74 v78.34,13.8
  Bottom 0.406: v78.34,13.8 78.35,13.78 78.35,12.17 R22.1
N$47  (1 unrouted)
  Top 0.61: C29.1 11.13,48.59
N$48  (12 unrouted)
  Top 0.406: 19.35,42.5 C19.1 19.27,42.42 18.7,42.42 17.93,41.66
N$50
  Bottom 0.406: R47.2 20.8,14.52 U10.2
N$51  (2 unrouted)
  Top 0.61: 17.01,48.93 16.66,49.28 | 16.66,49.28 13.36,49.28 12.93,49.71 C29.2 | 18.63,53.28 17.68,52.33 17.68,50.3 16.66,49.28
  Top 1.016: 23.59,53.28 28.77,48.1 L2.1
N$52  (1 unrouted)
  Top 0.406: 19.41,45.28 C38.2
  Top 0.61: C37.2 19.41,45.28 | 18.77,45.91 C38.2
N$53
  Top 0.61: R44.2 21.44,47.14 C37.1
N$54  (1 unrouted)
N$56  (1 unrouted)
N$58
  Top 0.406: U9.5 11.6,12.77 11.15,12.32 R48.1
N$59
  Top 0.406: C55.2 13.64,13.73 U9.4 13.5,14.84 13.94,15.29 R59.2 14.86,15.29 13.95,16.2 R34.2
N$63  (2 unrouted)
N$65  (2 unrouted)
N$66  (4 unrouted)
N$67  (2 unrouted)
N$68  (3 unrouted)
PEDAL  (via drill 0.41 pad 0.91)
  Top 0.813: OP1.4 87.27,13.51 v88.6,14.84
  Bottom 0.406: R19.1 87.62,18.66 87.63,18.65 87.63,18.34 88.6,17.38 v88.6,14.84
  Bottom 0.61: R19.1 87.62,19.64 R99.1
  Bottom 0.813: R99.1 90.5,21.47 92.15,23.12 TP5.1
  pour Top (no thermals): 85.96,13.01 85.96,10.98 89.77,10.98 89.77,13.01
PEDAL+  (via drill 0.3)
  Top 0.203: L3.1 71.54,29.79 v70.86,29.11
  Top 0.61: K1.2 12.34,19.57 12.37,19.55 v12.37,19.47
  GND 0.254: v12.37,19.47 13.92,21.02 19.08,21.02 19.55,21.49 19.55,27.59 21.16,29.2 38.01,29.2 v38.01,29.11
  PWR 0.254: v70.86,29.11 70.79,29.04 38.08,29.04 v38.01,29.11
PEDAL-  (via drill 0.3)
  Top 0.406: 78.27,15.54 v78.26,15.52
  Top 0.508: L4.1 78.27,15.54
  Top 0.61: v11.35,19.48 K1.1
  GND 0.254: v11.35,19.48 11.35,19.95 13.04,21.65 18.82,21.65 18.98,21.81 18.98,28.19 20.54,29.74 38.64,29.74 v38.67,29.77
  PWR 0.254: v78.26,15.52 76.39,17.39 76.39,28.79 75.41,29.77 v38.67,29.77
PEDAL_IP  (via drill 0.3 pad 0.64)
  Top 0.406: U6.4 59.84,41.15 v60.86,40.14 | 82.55,42.32 v82.4,42.17
  Bottom 0.406: v82.4,42.17 73.46,42.17 73.05,41.76 65.13,41.76 63.7,40.34 61.06,40.34 v60.86,40.14
PUSH  (via drill 0.3 pad 0.64, 0.41 pad 0.81)
  Top 0.406: TP9.1 60.1,37.47 60.1,39.63 v59.34,40.39 59.22,40.5 U6.5
  Top 0.508: R65.1 17.06,42.05 v17.43,42.42
  Bottom 0.406: v59.34,40.39 59.22,40.5 56.37,40.5 51.66,45.22 46.13,45.22 39.52,38.61 32.92,38.61 31.28,40.25 22.44,40.25 20.27,42.42 v17.43,42.42
PUSH_FILT  (via drill 0.3 pad 0.64, 0.41 pad 0.81)
  Top 0.406: U6.8 62.2,39.2 61.67,39.73 61.67,40.54 61.11,41.1 61.11,44.96 61.88,45.72 v61.88,47.6 | 88.69,44.92 v88.34,45.27
  Bottom 0.406: v61.88,47.6 63.3,49.03 67.21,49.03 68.48,47.76 82.96,47.76 83.79,48.59 87.41,48.59 88.55,47.45 88.55,45.47 v88.34,45.27
QSPI_SCLK  (1 unrouted)
QSPI_SD0  (1 unrouted)
QSPI_SD1  (1 unrouted)
QSPI_SD2  (1 unrouted)
QSPI_SD3  (1 unrouted)
QSPI_SS  (2 unrouted)
ROTA
  Top 0.406: 78.39,25.68 S1.A | U3.5 73.58,34.18 73.43,34.04 73.43,32.39 73.69,32.13 74.96,32.13 75.72,31.37 76.85,31.37 R53.1
  Top 0.813: R53.1 77.82,30.4 77.82,26.83 78.39,26.27
  Top 1.016: 78.39,26.27 78.39,25.68
  Bottom 0.813: C23.2 78.78,25.29
  Bottom 1.016: 78.78,25.29 S1.A
ROTA_FILT  (via drill 0.41 pad 0.81)
  Top 0.406: U3.4 72.92,35.89 75.59,38.56 v75.59,40.01 | 83.23,40.03 83.59,40.39 v83.59,40.9
  Bottom 0.406: v75.59,40.01 76.35,41.15 83.34,41.15 v83.59,40.9
ROTB  (via drill 0.3 pad 0.64)
  Top 0.406: U3.11 72.92,37.16
  Top 0.508: R52.1 77.89,20.05 S1.B
  Top 0.61: 72.92,37.16 v72.39,36.63
  Top 0.813: v85.75,21.85 80.95,21.85 79.67,20.58 S1.B
  Bottom 0.406: 78.13,35.06 79.4,33.79 81.84,33.79 83.16,32.47
  Bottom 0.61: 83.16,32.47 83.16,28.81 85.5,26.47 85.5,22.1 v85.75,21.85 | 78.13,35.06 74.47,35.06 72.9,36.63 v72.39,36.63
  Bottom 0.813: C22.2 79.81,21.99 S1.B
ROTB_FILT
  Top 0.406: 81.6,41.49 80.67,42.42 75.34,42.42 74.88,41.97 U3.8
ROTPUSH  (via drill 0.3 pad 0.64)
  Top 0.406: U3.1 70.98,33.84 | S1.SW+ 92.89,15.85 92.63,15.58 R54.1
  Top 0.61: v81.79,26.32 87.15,26.32 S1.SW+ | 70.98,33.84 v69.95,32.82
  Top 1.016: C24.2 94.44,19.03 S1.SW+
  Bottom 0.61: v69.95,32.82 70.51,32.26 75.03,32.26 80.98,26.32 v81.79,26.32
RPUSH_FILT  (via drill 0.3 pad 0.64)
  Top 0.406: U3.12 72.28,43.58 v71.88,44 | 87.89,43.38 87.58,43.69 v87.15,43.69
  Bottom 0.406: v87.15,43.69 87.15,43.06 86.77,42.68 85.75,42.68 84.23,44.2 72.09,44.2 v71.88,44
RST
  Top 0.406: J6.5
  Top 0.61: R21.2 J6.5
RX-I  (via drill 0.3 pad 0.64)
  Top 0.406: J4.P$3 93.37,39.63 92.74,40.26 92.74,44.84 89.82,47.76 87.28,47.76 v86.51,46.99 | 84.69,45.26 v83.72,46.23
  Bottom 0.406: v86.51,46.99 84.48,46.99 v83.72,46.23
SAFETY_EN_DCDC  (via drill 0.35)
  Top 0.406: v1.8,14.75 Q5.3
  Bottom 0.406: Q4.1 8.03,47.48 9.63,49.08 R27.1 R42.2 9.05,49.53 2.88,49.53 1.36,48.01 1.36,44.35 3.83,41.88 3.83,26.62 6.62,23.82 6.62,17.64 3.76,14.77 1.81,14.77 v1.8,14.76 v1.8,14.75
SCK  (via drill 0.3 pad 0.64)
  Top 0.406: R14.1 44.6,51.31 v45.11,50.8
  Bottom 0.406: v45.11,50.8 65.69,50.8 68.23,53.34 69.75,53.34
SCL  (via drill 0.3 pad 0.64)  (1 unrouted)
  Top 0.406: 31.15,31.38 TP7.1 | 86.29,43.66 v86.26,43.69 | v39.27,39.63 39.27,35.31 v38.76,34.8 | 80.86,43.48 81.38,44 v81.38,44.96
  Bottom 0.406: TP7.1 31.65,32.26 34.19,34.8 v38.76,34.8 | v39.27,39.63 45.87,46.23 55.53,46.23 56.14,45.62 68.17,45.62 68.99,46.44 79.96,46.44 81.38,45.01 v81.38,44.96 81.64,44.81 85.65,44.81 86.26,44.2 v86.26,43.69
SDA  (via drill 0.3 pad 0.64)  (2 unrouted)
  Top 0.406: 87.09,41.22 v87.02,41.15 | 31.27,35.69 31.65,35.31 TP6.1 | v38.25,39.88 38.25,36.07 v37.75,35.56
  Bottom 0.406: 87.35,40.06 87.02,40.39 v87.02,41.15 87.58,41.15 87.99,41.56 87.99,44 86.56,45.42 82.2,45.42 80.57,47.05 68.58,47.05 67.77,46.23 56.8,46.23 54.51,48.52 46.89,48.52 v38.25,39.88 | TP6.1 32.41,34.04 33.94,35.56 v37.75,35.56
SEL  (via drill 0.3, 0.35)
  Top 0.406: v13.35,24.47 v13.34,24.47 K1.3 | 84.69,32.7 82.36,30.37 v79.47,30.37
  GND 0.254: v39.3,30.44 39.27,30.41 20.06,30.41 17.85,28.2 16.25,28.2 v16.25,28.16
  PWR 0.254: v79.47,30.37 79.38,30.27 39.45,30.27 v39.3,30.44 | v13.35,24.47 13.35,26.9 14.65,28.2 16.21,28.2 v16.25,28.16
SPARE  (via drill 0.35)
  Top 0.406: U6.1 57.29,43.1 C9.1 | R18.2 57.21,44.44 C9.1 | C9.1 54.64,44.44 53.89,43.69 53.89,37.56 54.44,37.01 57.79,37.01 63.98,30.82 75.36,30.82 v76.75,29.43
  PWR 0.406: v76.75,29.43 83.27,22.91 86.94,22.91 v86.96,22.89
  Bottom 0.61: v86.96,22.89 86.96,22.16 R99.2
SPARE2
  Top 0.203: 86.29,32.76 86.7,32.35 86.94,32.35 88.94,30.35 92.1,30.35 R38.1
SS  (via drill 0.3 pad 0.61, 0.3 pad 0.64)
  Top 0.406: R29.1 54.76,49.53 53.49,48.26 53.49,45.72 v53.75,45.47 | 87.09,35.62 86.26,36.45 86.26,40.9 v85.98,41.18
  Bottom 0.406: v53.75,45.47 54.41,44.81 65.33,44.81 66.96,43.18 72.44,43.18 72.85,43.59 83.62,43.59 86.01,41.2 v85.98,41.18
TX-O  (via drill 0.3 pad 0.64, 0.41 pad 0.81)
  Top 0.406: J4.P$2 94.13,37.6 91.98,39.76 91.98,44.58 89.56,46.99 v87.78,46.99 | 83.89,44.84 82.7,46.03 v82.7,46.23
  Bottom 0.406: v87.78,46.99 87.78,47.25 87.28,47.76 83.87,47.76 82.7,46.59 v82.7,46.23
USB_D+  (2 unrouted)
USB_D-  (2 unrouted)
VBUS_SENSE  (via drill 0.3, 0.35)
  Top 0.406: 88.8,40.03 v88.67,40.16 | D7.3 14.68,31.49 R50.1 13,31.51 C58.2 12.09,31.45 v11.73,31.8
  PWR 0.406: v11.73,31.8 12.84,32.91 28.89,32.91 31.14,35.16 35.64,35.16 37.05,36.58 38.12,36.58 39.33,35.37 57.04,35.37 58.84,37.17 69.44,37.17 71.88,39.6 71.88,43.03 72.13,43.29 72.18,43.29 72.92,44.03 72.92,46.18 76.3,49.55 86.28,49.55 89.51,46.33 89.51,40.47 89.2,40.16 v88.67,40.16
  Bottom 0.406: v11.73,31.8 11.54,31.99 R51.2
VCC  (via drill 0.41 pad 0.9, 0.41 pad 0.91)  (11 unrouted)
  Top 0.406: 6.44,48.8 C18.1 8.55,48.85 8.87,48.53 C28.2 11.24,47.21 | C21.1 1.6,44.82 1.6,48.8 C17.1 4.65,48.8
  Top 0.508: 6.44,48.8 C17.1 | v4.65,47.95 4.65,48.8 | v5.54,47.92 5.45,48.01 5.45,48.74 6.38,48.74 C18.1
  Top 1.016: PTC1.1 8.09,33.81 v8.3,34.02 | v10.23,31.82 8.59,31.82 PTC1.1 | PTC1.1 8.09,28.93 v8.31,28.72
  Bottom 0.406: v4.65,47.95 4.11,47.4 R41.2 | C35.1 10.02,30.11 10.02,31.61 v10.23,31.82
  other vias: 10.16,33.8
  pour Top: 7.52,34.55 11.09,34.55 11.12,34.51 11.12,27.92 7.52,27.92
  pour PWR (isolate 0.254): 4.19,35.51 4.19,49.59 11.11,49.59 11.11,33.21 11.28,33.04 28.88,33.04 30.98,35.14 35.86,35.14 37.02,36.3 37.02,36.56 37.06,36.6 38.18,36.6 39.29,35.49 39.29,35.31 56.72,35.31 56.85,35.44 57.06,35.44 58.86,37.24 69.48,37.24 71.8,39.56 71.8,44.96 76.29,49.45 86.67,49.45 89.33,46.79 89.33,46.27 88.99,45.93 76.57,45.93 75.35,44.71 75.35,28.76 10.94,28.76
VCC-ISO  (via drill 0.35, 0.4 pad 0.9, 0.41 pad 0.81, 0.41 pad 0.91)  (37 unrouted)
  Top 0.305: C25.2 | C26.1 | 2.31,36.86 R13.2 | 1.63,36.87 v0.92,37.58
  Top 0.406: U6.14 63.73,43.16 63.73,43.28 63.63,43.38 v62.91,43.38 | U3.14 70.52,41.16 | 11.6,11.12 10.8,11.12 v10.45,10.77 | R52.2 78.4,16.5 79.51,16.5 v80.3,17.29 | v14.29,19.85 14.29,21.84 K1.4 14.34,23.2 14.35,23.2 14.35,25.51 13.8,26.05 12.82,26.05 12.48,26.38 12.05,25.95 10.3,25.95 | C57.2 9.45,25.95 10.3,25.95 | v10.1,25.7 10.1,25.75 10.3,25.95
  Top 0.508: 70.52,41.16 v70.13,40.77
  Top 0.61: J6.2 42.07,54.75 41.68,54.36 C25.2 | C25.2 41.69,52.06 42.19,51.57 C26.1 | 2.31,36.86 2.31,35.61 C2.2 | R54.2 90.49,15.33 v89.82,16.01 | C12.2 95.03,29.86 v95.15,29.98 | R53.2 77.99,33.16 v78.13,33.02 | R35.1 58.67,49.62 58.32,49.28 v58.32,48.77 | R66.1 v56.29,49.03 | R13.2 1.63,36.87
  PWR 0.406: v0.92,37.58 1.03,37.58 11,27.61 11,26.6 v10.1,25.7 | v14.29,19.85 14.29,17.82 10.46,13.99 10.46,10.78 v10.45,10.77
  Bottom 0.305: 61.76,43.06 C20.2
  Bottom 0.406: 61.76,43.06 62.58,43.06 v62.91,43.38
  Bottom 0.61: C53.2 70.39,40.52 v70.13,40.77 | R19.2 89.42,16.4 v89.82,16.01 | J6.2 42.43,55.59
  pour PWR (isolate 0.305, rank 3): -0.3,28.53 -0.3,53.39 7.02,60.71 89.42,60.71 96.34,53.79 96.34,7.88 75,7.88 75,44.88 76.33,46.21 87.58,46.21 87.58,49.79 75.78,49.79 71.36,45.37 71.36,38.87 69.61,37.12 58.81,37.12 57.13,35.44 31.27,35.22 29.11,33.04 11.08,33.28 11.08,49.14 4.33,49.14 4.2,35.53 11.08,28.65 11.08,28.53
VCCA  (5 unrouted)
VCCIO
  Top 0.61: TP2.1 49.73,33.96 50.96,35.19
  pour Top (no thermals): 77.58,13.01 77.58,10.98 80.88,10.98 80.88,13.01
VIN_ALARM  (via drill 0.41 pad 0.81)
  Top 0.406: TP10.1 65.31,49.03 63.4,49.03 62.69,48.31 62.69,45.16 61.72,44.2 61.72,41.51 62.73,40.5 U6.10 64.96,40.5 66.39,39.08 66.39,38.36 66.95,37.23 v66.95,34.61 | v81.89,32.29 82.02,32.41 82.02,33.35 82.4,33.73
  Bottom 0.406: v66.95,34.61 66.99,34.65 70.82,34.65 71.22,34.24 75.69,34.24 78.05,31.88 81.49,31.88 v81.89,32.29
VO_TPS  (via drill 0.41 pad 0.91)
  Top 0.406: U4.5 37.82,45.65 | R12.1 34.32,39.76 v34.44,39.63 | 21.14,42.5 C19.2 | 22.75,42.48 C34.2
  Top 0.508: TP14.1 31.7,54.56 31.74,54.53
  Top 0.61: R11.2 21.14,42.5 | C19.2 22.75,42.48
  Top 0.813: C43.1 37.12,46.35 37.82,45.65 | C34.2 22.84,41.58 v23.01,41.41 | v38,44.71 38,45.27 U4.5
  Top 1.016: L2.2 31.74,54.53 37.12,49.14 C43.1
  Bottom 0.406: C41.1 34.57,42.31 34.57,39.76 v34.44,39.63
  Bottom 0.508: 34.62,41.51 36.33,41.51 37.95,43.13 37.95,44.65
  Bottom 0.813: 34.57,42.31 C39.1 C40.1 C42.1 25.64,41.75 25.3,41.41 v23.01,41.41 | C41.1 34.62,41.51 | 37.95,44.65 v38,44.71
  other vias: 35.44,39.63 33.44,39.63
  pour Top (isolate 0.254, no thermals): 32.8,40.45 32.8,39.05 33.1,38.75 35.85,38.75 36.1,39 36.1,40.2 35.9,40.4
  pour Bottom (isolate 0.254, no thermals): 32.95,41.15 32.95,39.7 33.4,39.25 35.75,39.25 35.95,39.45 35.95,41.4 35.55,41.8 33.6,41.8
VOSEN  (via drill 0.41 pad 0.81)
  Top 0.406: 88.03,36.83 v87.66,36.45
  Bottom 0.406: 33.17,32.16 33.17,30.48 32.41,29.72 22.48,29.72 21.9,30.3 20.76,30.3 20.72,30.26 | 33.17,32.16 33.17,32.77 34.44,34.04 42.32,34.04 45.37,37.09 59.34,37.09 60.1,37.85 72.7,37.85 74.73,35.82 78.39,35.82 79.47,34.74 86.45,34.74 87.02,35.31 87.02,35.82 v87.66,36.45 | R36.1 19.16,25.78 19.16,27.13 | TP3.1 33.17,32.16
  Bottom 0.508: C13.2 R37.2 20.59,29.04 20.72,29.17 20.72,30.26
  Bottom 0.61: 19.16,27.13 R37.2 | 20.72,30.26 D2.3
VOUT  (via drill 0.3 pad 0.64, 0.4 pad 0.64, 0.41 pad 0.91)
  Top 0.305: TP11.1 19.69,19.25 17.1,19.25 | K1.7 16.34,20.01 17.1,19.25 | K1.5 15.34,19.91 16,19.25 17.1,19.25
  Top 0.406: R12.2 34.32,35.95
  Top 0.508: R1.2 37.1,38.45 R12.2 | v16.06,24.6 16.34,24.31
  Top 0.61: 34.32,35.95 v33.17,37.09 | 16.34,24.31 K1.7 | K1.5 15.34,23.88 v16.06,24.6
  Bottom 0.61: v33.17,37.09 33.03,37.09 32.02,38.1 20.67,38.1 16.69,34.12
  Bottom 0.813: 16.69,34.12 14.92,34.12 14.46,33.66 D8.C 14.56,31.87 14.56,30 | v14.51,27.05 14.61,27.15 14.61,29.95 15.52,29.04 R37.1 | v14.51,27.05 15.6,27.05 15.8,26.85 | v14.51,27.05 14.55,27.01 14.55,26.15 | v14.51,27.05 14.36,26.9 14,26.9
  other vias: 15.46,25.5 15.66,27.05 34.27,37.09 35.37,37.09
  pour Top (isolate 0.254): 16.55,24.05 14.75,24.05 14.65,23.95 14.65,25.65 13.8,26.5 13.8,27.6 16.55,27.6
  pour Bottom (isolate 0.254): 13.65,30.95 17.2,30.95 17.2,24.3 16.75,23.85 14.85,23.85 14.85,25.35 13.65,26.55
  pour Top (isolate 0.406, no thermals): 32.75,37.7 32.75,36.5 32.9,36.35 35.7,36.35 35.9,36.55 35.9,37.55 35.75,37.7
  pour Bottom (isolate 0.254, no thermals): 35.9,37.7 32.75,37.7 32.75,36.6 32.85,36.5 35.85,36.5 35.9,36.55
XIN  (2 unrouted)
XOUT  (1 unrouted)

## Text on the board
tPlace: MK2r1-MAY22 | +5V | GND | + | RST | + | +
bPlace: V_TPS | #SER: | ISEN | ISENSE | OVC_ALARM | 12V | PUSH | SDA | VOSEN | SCL | SPARE2 | GND | PEDAL | VOUT